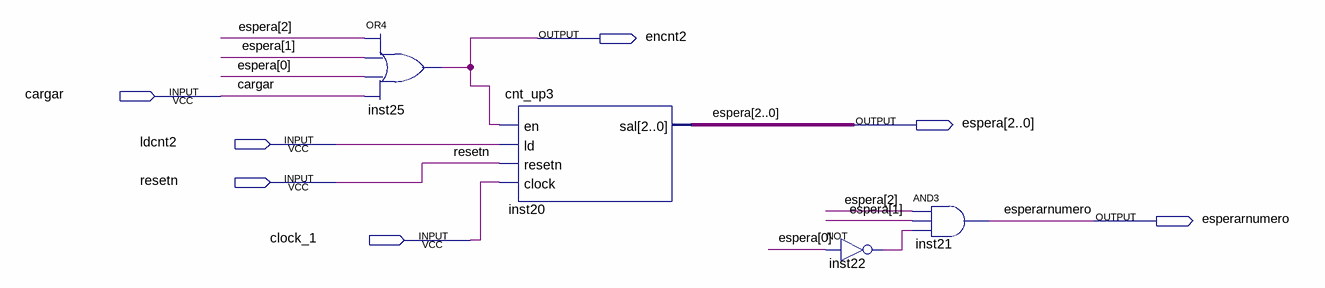
[diagram p0: schematic sheet]
// Quartus schematic contador_up.bdf as structural Verilog: 4 symbols, 7 pins
module contador_up (
  input  cargar,
  input  ldcnt2,
  input  resetn,
  input  clock_1,
  output encnt2,
  output [2:0] espera,
  output esperarnumero
);

  wire inst22_out;

  or inst25 (encnt2, espera[2], espera[1], espera[0], cargar);
  cnt_up3 inst20 (.en(encnt2), .ld(ldcnt2), .resetn(resetn), .clock(clock_1), .sal(espera));
  not inst22 (inst22_out, espera[0]);
  and inst21 (esperarnumero, espera[2], espera[1], inst22_out);
endmodule
